# Altium project TMDX654GPEVM.PrjPcb (part 2 of 24)

## Sheet 12-SoC POWER2.SchDoc
size 513 x 386 mm
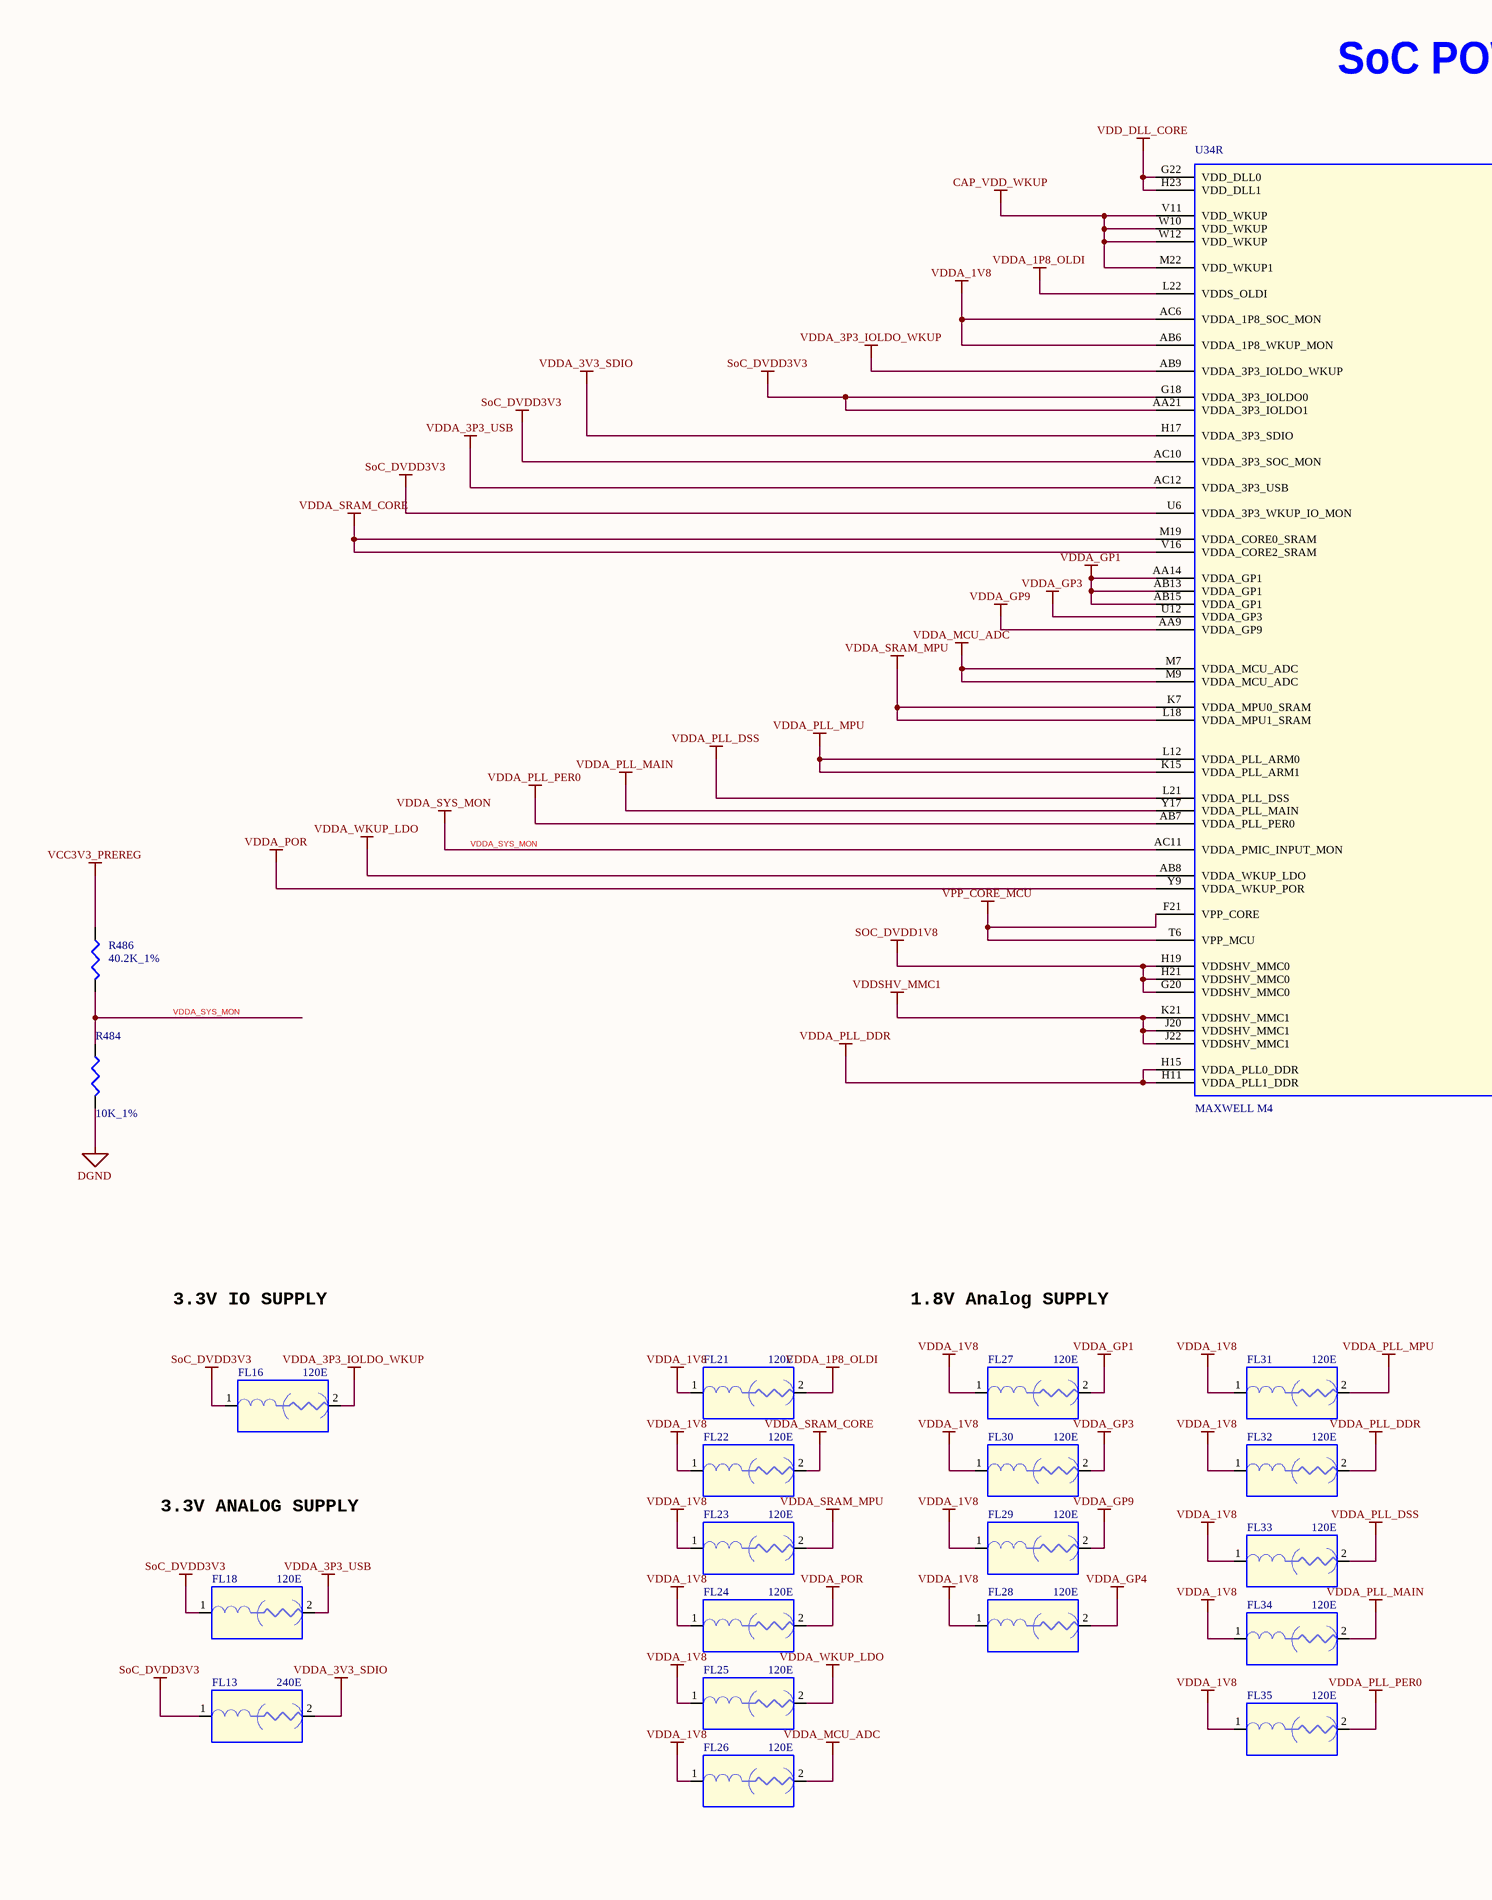
[diagram p15: 12-SoC POWER2.SchDoc, left]
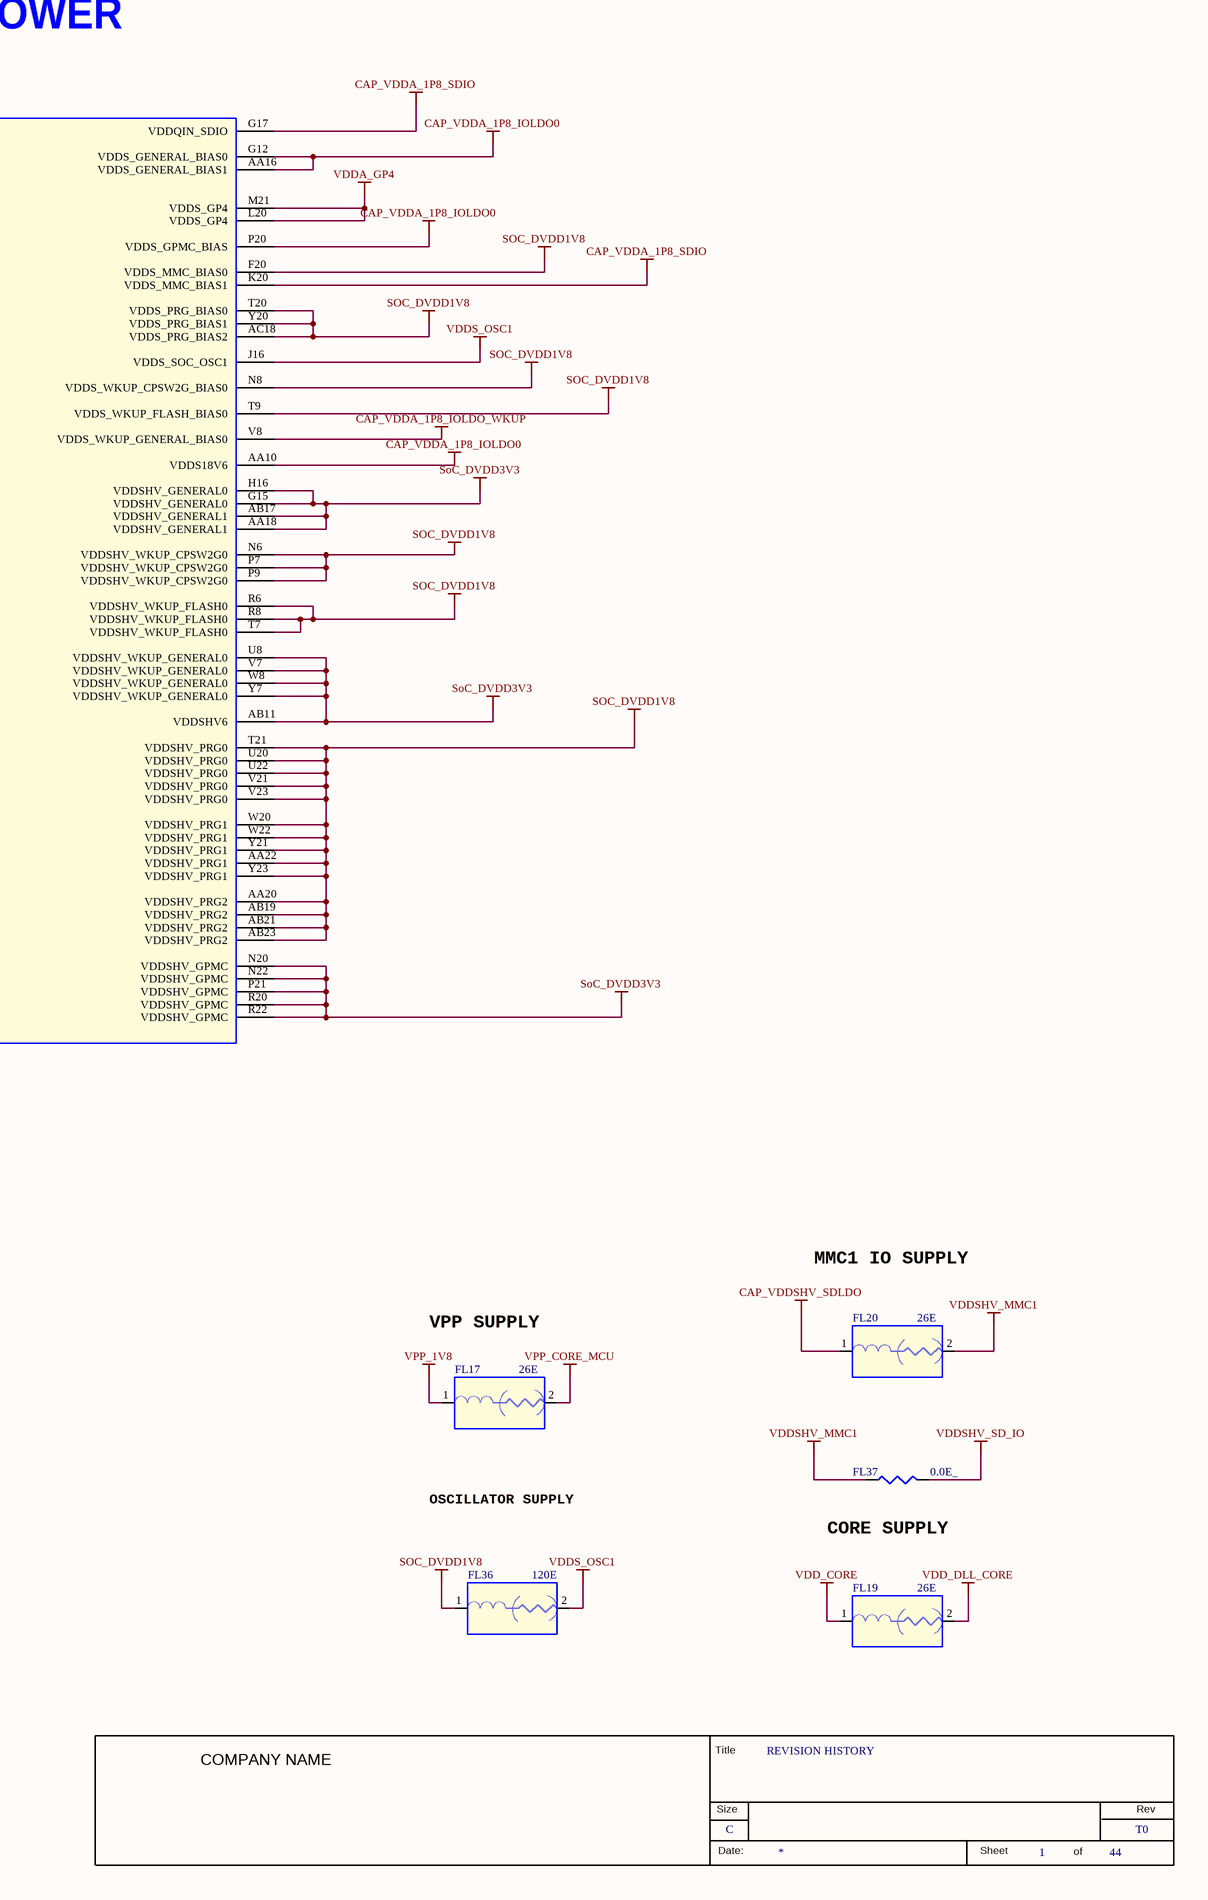
[diagram p16: 12-SoC POWER2.SchDoc, right]

### Parts
(Parts that share a designator on the sheet are numbered #1, #2 ... from top to bottom, then left to right.)
*#12  RevCode: T0  Title: REVISION HISTORY  Page Size: C  Page Number: 1  Page Count: 44  (hidden comment: TRAINING_TITLEBLK_CSIZE)  (graphical)
FL13  240E  [EMIFIL_BLM03B_0201]
FL16  120E  [EMIFIL_BLM18R_0603_1]
FL17  26E  [EMIFIL_BLM18K_0603]
FL18  120E  [EMIFIL_BLM18R_0603_1]
FL19  26E  [EMIFIL_BLM18K_0603]
FL20  26E  [EMIFIL_BLM18K_0603]
FL21  120E  [EMIFIL_BLM18R_0603_1]
FL22  120E  [EMIFIL_BLM18R_0603_1]
FL23  120E  [EMIFIL_BLM18R_0603_1]
FL24  120E  [EMIFIL_BLM18R_0603_1]
FL25  120E  [EMIFIL_BLM18R_0603_1]
FL26  120E  [EMIFIL_BLM18R_0603_1]
FL27  120E  [EMIFIL_BLM18R_0603_1]
FL28  120E  [EMIFIL_BLM18R_0603_1]
FL29  120E  [EMIFIL_BLM18R_0603_1]
FL30  120E  [EMIFIL_BLM18R_0603_1]
FL31  120E  [EMIFIL_BLM18R_0603_1]
FL32  120E  [EMIFIL_BLM18R_0603_1]
FL33  120E  [EMIFIL_BLM18R_0603_1]
FL34  120E  [EMIFIL_BLM18R_0603_1]
FL35  120E  [EMIFIL_BLM18R_0603_1]
FL36  120E  [EMIFIL_BLM18R_0603_1]
FL37  0.0E_  [RES0603]
R484  10K_1%  [RES0402_0-5]
R486  40.2K_1%  [RES0402_0-5]
U34  MAXWELL M4  [BGA784_31-49_910X910_1-7]  (part R of 19)

### Nets
CAP_VDD_WKUP: U34.M22(VDD_WKUP1) U34.V11(VDD_WKUP) U34.W10(VDD_WKUP) U34.W12(VDD_WKUP)
CAP_VDDA_1P8_IOLDO0: U34.AA10(VDDS18V6) U34.AA16(VDDS_GENERAL_BIAS1) U34.G12(VDDS_GENERAL_BIAS0) U34.P20(VDDS_GPMC_BIAS)
CAP_VDDA_1P8_IOLDO_WKUP: U34.V8(VDDS_WKUP_GENERAL_BIAS0)
CAP_VDDA_1P8_SDIO: U34.G17(VDDQIN_SDIO) U34.K20(VDDS_MMC_BIAS1)
CAP_VDDSHV_SDLDO: FL20.1
DGND: R484.2
SOC_DVDD1V8: FL36.1 U34.AA20(VDDSHV_PRG2) U34.AA22(VDDSHV_PRG1) U34.AB19(VDDSHV_PRG2) U34.AB21(VDDSHV_PRG2) U34.AB23(VDDSHV_PRG2) U34.AC18(VDDS_PRG_BIAS2) U34.F20(VDDS_MMC_BIAS0) U34.G20(VDDSHV_MMC0) U34.H19(VDDSHV_MMC0) U34.H21(VDDSHV_MMC0) U34.N6(VDDSHV_WKUP_CPSW2G0) U34.N8(VDDS_WKUP_CPSW2G_BIAS0) U34.P7(VDDSHV_WKUP_CPSW2G0) U34.P9(VDDSHV_WKUP_CPSW2G0) U34.R6(VDDSHV_WKUP_FLASH0) U34.R8(VDDSHV_WKUP_FLASH0) U34.T7(VDDSHV_WKUP_FLASH0) U34.T9(VDDS_WKUP_FLASH_BIAS0) U34.T20(VDDS_PRG_BIAS0) U34.T21(VDDSHV_PRG0) U34.U20(VDDSHV_PRG0) U34.U22(VDDSHV_PRG0) U34.V21(VDDSHV_PRG0) U34.V23(VDDSHV_PRG0) U34.W20(VDDSHV_PRG1) U34.W22(VDDSHV_PRG1) U34.Y20(VDDS_PRG_BIAS1) U34.Y21(VDDSHV_PRG1) U34.Y23(VDDSHV_PRG1)
SoC_DVDD3V3: FL13.1 FL16.1 FL18.1 U34.AA18(VDDSHV_GENERAL1) U34.AA21(VDDA_3P3_IOLDO1) U34.AB11(VDDSHV6) U34.AB17(VDDSHV_GENERAL1) U34.AC10(VDDA_3P3_SOC_MON) U34.G15(VDDSHV_GENERAL0) U34.G18(VDDA_3P3_IOLDO0) U34.H16(VDDSHV_GENERAL0) U34.N20(VDDSHV_GPMC) U34.N22(VDDSHV_GPMC) U34.P21(VDDSHV_GPMC) U34.R20(VDDSHV_GPMC) U34.R22(VDDSHV_GPMC) U34.U6(VDDA_3P3_WKUP_IO_MON) U34.U8(VDDSHV_WKUP_GENERAL0) U34.V7(VDDSHV_WKUP_GENERAL0) U34.W8(VDDSHV_WKUP_GENERAL0) U34.Y7(VDDSHV_WKUP_GENERAL0)
VCC3V3_PREREG: R486.1
VDD_CORE: FL19.1
VDD_DLL_CORE: FL19.2 U34.G22(VDD_DLL0) U34.H23(VDD_DLL1)
VDDA_1P8_OLDI: FL21.2 U34.L22(VDDS_OLDI)
VDDA_1V8: FL21.1 FL22.1 FL23.1 FL24.1 FL25.1 FL26.1 FL27.1 FL28.1 FL29.1 FL30.1 FL31.1 FL32.1 FL33.1 FL34.1 FL35.1 U34.AB6(VDDA_1P8_WKUP_MON) U34.AC6(VDDA_1P8_SOC_MON)
VDDA_3P3_IOLDO_WKUP: FL16.2 U34.AB9(VDDA_3P3_IOLDO_WKUP)
VDDA_3P3_USB: FL18.2 U34.AC12(VDDA_3P3_USB)
VDDA_3V3_SDIO: FL13.2 U34.H17(VDDA_3P3_SDIO)
VDDA_GP1: FL27.2 U34.AA14(VDDA_GP1) U34.AB13(VDDA_GP1) U34.AB15(VDDA_GP1)
VDDA_GP3: FL30.2 U34.U12(VDDA_GP3)
VDDA_GP4: FL28.2 U34.L20(VDDS_GP4) U34.M21(VDDS_GP4)
VDDA_GP9: FL29.2 U34.AA9(VDDA_GP9)
VDDA_MCU_ADC: FL26.2 U34.M7(VDDA_MCU_ADC) U34.M9(VDDA_MCU_ADC)
VDDA_PLL_DDR: FL32.2 U34.H11(VDDA_PLL1_DDR) U34.H15(VDDA_PLL0_DDR)
VDDA_PLL_DSS: FL33.2 U34.L21(VDDA_PLL_DSS)
VDDA_PLL_MAIN: FL34.2 U34.Y17(VDDA_PLL_MAIN)
VDDA_PLL_MPU: FL31.2 U34.K15(VDDA_PLL_ARM1) U34.L12(VDDA_PLL_ARM0)
VDDA_PLL_PER0: FL35.2 U34.AB7(VDDA_PLL_PER0)
VDDA_POR: FL24.2 U34.Y9(VDDA_WKUP_POR)
VDDA_SRAM_CORE: FL22.2 U34.M19(VDDA_CORE0_SRAM) U34.V16(VDDA_CORE2_SRAM)
VDDA_SRAM_MPU: FL23.2 U34.K7(VDDA_MPU0_SRAM) U34.L18(VDDA_MPU1_SRAM)
VDDA_SYS_MON: R484.1 R486.2 U34.AC11(VDDA_PMIC_INPUT_MON)
VDDA_WKUP_LDO: FL25.2 U34.AB8(VDDA_WKUP_LDO)
VDDS_OSC1: FL36.2 U34.J16(VDDS_SOC_OSC1)
VDDSHV_MMC1: FL20.2 FL37.1 U34.J20(VDDSHV_MMC1) U34.J22(VDDSHV_MMC1) U34.K21(VDDSHV_MMC1)
VDDSHV_SD_IO: FL37.2
VPP_1V8: FL17.1
VPP_CORE_MCU: FL17.2 U34.F21(VPP_CORE) U34.T6(VPP_MCU)

### Notes on the sheet
- SoC POWER
- 3.3V IO SUPPLY
- 1.8V Analog SUPPLY
- MMC1 IO SUPPLY
- VPP SUPPLY
- 3.3V ANALOG SUPPLY
- OSCILLATOR SUPPLY
- (near FL37) CORE SUPPLY
- (in symbol TRAINING_TITLEBLK_CSIZE) Title; COMPANY NAME; Size; Rev; Date:; Sheet; of

### Library data of the parts
*#12 = TRAINING_TITLEBLK_CSIZE: Issue: 1.0; Page Create Date: Jan  8, 2022; Page Modify Date: *
FL13 = EMIFILTER_IND: FERRITE CHIP 240E 350mA 0201; Mistral Part No: 130014070021-R; Mfr_name: MURATA; Mfr_part_number: BLM03AX241SN1D; Part_type: MISC\FILTER; Project: HUMANWARE_PHOENIX; Tolerance: NA; Customs_HS_Code: 85437099; Custom_Duty: 24%; Library Ref: EMIFILTER_IND; PCB Footprint: EMIFIL_BLM03B_0201; Voltage: NA; Wattage: NA; Package: 0201; Distributor_name: DIGIKEY; Distributor_part_number: 490-5623-1-ND; Height: 0.33MM; Weight: NA; Temperature: -55°C+125°C; Datasheet: Y:\MIS_DATABASE\DATASHEETS\DISCRETES\INDUCTORS\BLM03AX.PDF; Crtd /date: NAVEED/140714; Chkd/date: VASANTHA/070814
FL16 FL18 FL21-FL23 FL25 FL27 FL30 FL32-FL35 = EMIFILTER_IND: FERRITE BEAD 120E 2A 0603; Mistral Part No: 130010060030-R; Mfr_name: MURATA; Mfr_part_number: BLM18EG121SN1D; Part_type: MISC\FILTER; Project: CENTAURUS; Tolerance: NA; Customs_HS_Code: 85437099; Custom_Duty: 24%; Footprint Path: Y:\MIS_DATABASE\Library\ALTIUM_TOOL\PCB_FOOTPRINTS\Altium_Footprint_Lib.PcbLib; Library Path: Y:\MIS_DATABASE\Library\ALTIUM_TOOL\SCHEMATICS_PARTS\MS_FILTER_Library.schlib; PCB Footprint: EMIFIL_BLM18R_0603_1; Voltage: NA; Wattage: NA; Package: 0603; Distributor_name: DIGIKEY; Distributor_part_number: 490-3991-1-ND; Library Ref: EMIFILTER_IND; Footprint Ref: EMIFIL_BLM18R_0603_1; Height: 0.95MM; Weight: NA; Temperature: -55°C+125°C; Datasheet: Y:\MIS_DATABASE\DATASHEETS\DISCRETES\INDUCTORS\BLM18E.PDF; Crtd /date: MUDDU/190610; Chkd/date: VASANTHA/061216; MECHANICAL 3D STEP FILE: EMIFIL_BLM18R_0603_1
FL17 = EMIFILTER_IND: FERRITE CHIP 26E 6A 0603; Mistral Part No: 130012010003-R; Mfr_name: MURATA; Mfr_part_number: BLM18KG260TN1D; Part_type: MISC\FILTER; Project: NA10NG; Tolerance: NA; Customs_HS_Code: 85437099; Custom_Duty: 24%; PCB Footprint: EMIFIL_BLM18K_0603; Voltage: NA; Wattage: NA; Package: 0603; Distributor_name: DIGIKEY; Distributor_part_number: 490-5252-1-ND; Library Ref: EMIFILTER_IND; Height: 0.75MM; Weight: NA; Temperature: -55°C+125°C; Datasheet: Y:\MIS_DATABASE\DATASHEETS\DISCRETES\INDUCTORS\BLM18K-SERIES.PDF; Crtd /date: CHAITHANYA/020112; Chkd/date: USMAN/020112
FL19 FL20 = EMIFILTER_IND: FERRITE CHIP 26E 6A 0603; Part_type: MISC\FILTER; Mfr_part_number: BLM18KG260TN1D; Mfr_name: MURATA; Mistral Part No: 130012010003-R; Custom_Duty: 24%; Customs_HS_Code: 85437099; Wattage: NA; Project: NA10NG; PCB Footprint: EMIFIL_BLM18K_0603; Chkd/date: USMAN/020112; Crtd /date: CHAITHANYA/020112; Datasheet: Y:\MIS_DATABASE\DATASHEETS\DISCRETES\INDUCTORS\BLM18K-SERIES.PDF; Temperature: -55°C+125°C; Weight: NA; Height: 0.75MM; Library Ref: EMIFILTER_IND; Distributor_part_number: 490-5252-1-ND; Distributor_name: DIGIKEY; Package: 0603; Voltage: NA; Tolerance: NA
FL24 FL26 FL28 FL29 FL31 FL36 = EMIFILTER_IND: FERRITE BEAD 120E 2A 0603; Part_type: MISC\FILTER; Mfr_part_number: BLM18EG121SN1D; Mfr_name: MURATA; Mistral Part No: 130010060030-R; Custom_Duty: 24%; Customs_HS_Code: 85437099; Wattage: NA; Project: CENTAURUS; Footprint Path: Y:\MIS_DATABASE\Library\ALTIUM_TOOL\PCB_FOOTPRINTS\Altium_Footprint_Lib.PcbLib; Library Path: Y:\MIS_DATABASE\Library\ALTIUM_TOOL\SCHEMATICS_PARTS\MS_FILTER_Library.schlib; PCB Footprint: EMIFIL_BLM18R_0603_1; MECHANICAL 3D STEP FILE: EMIFIL_BLM18R_0603_1; Chkd/date: VASANTHA/061216; Crtd /date: MUDDU/190610; Datasheet: Y:\MIS_DATABASE\DATASHEETS\DISCRETES\INDUCTORS\BLM18E.PDF; Temperature: -55°C+125°C; Weight: NA; Height: 0.95MM; Footprint Ref: EMIFIL_BLM18R_0603_1; Library Ref: EMIFILTER_IND; Distributor_part_number: 490-3991-1-ND; Distributor_name: DIGIKEY; Package: 0603; Voltage: NA; Tolerance: NA
FL37 = RESISTOR: RES 0.0E 1/10W 0603; Mistral Part No: 110010020006-P; Mfr_name: VISHAY; Mfr_part_number: CRCW06030000Z0EA; Part_type: RESISTORS\FIXED; Project: NPOL_CONTROLLERCARD; Voltage: 50V; Customs_HS_Code: 85332119; Custom_Duty: 15%; Wattage: 1/10W; Package: 0603; Distributor_name: DIGIKEY; Distributor_part_number: 541-0.0GCT-ND; Library Ref: RESISTOR; Height: 0.55MM; Weight: 2g/1000pcs; Temperature: -55°C+125°C; Datasheet: Y:\MIS_DATABASE\DATASHEETS\RESISTORS\CRCW.PDF; Crtd /date: MUDDU/050210; Chkd/date: SUHAS/230910; RoHS: Pb-Free; PCB Footprint: RES0603
R484 = RESISTOR_Dup5: RES 10K 1/16W 1% 0402; Part_type: RESISTORS\FIXED; Mfr_part_number: RC0402FR-0710KL; Mfr_name: YAGEO AMERICA; Mistral Part No: 110009030220-P; Custom_Duty: 15%; Customs_HS_Code: 85332119; Voltage: NA; Project: VOCERA; Footprint Path: Y:\MIS_DATABASE\Library\ALTIUM_TOOL\PCB_FOOTPRINTS\Altium_Footprint_Lib.PcbLib; Library Path: Y:\MIS_DATABASE\Library\ALTIUM_TOOL\SCHEMATICS_PARTS\MS_DISCRETE_Library.schlib; Footprint Ref: RES0402_0-5; Library Ref: RESISTOR; MECHANICAL 3D STEP FILE: RES0402_0-5; PCB Footprint: RES0402_0-5; RoHS: Pb-Free; Chkd/date: VASANTHA/201216; Crtd /date: GEETHA/290506; Datasheet: Y:\MIS_DATABASE\DATASHEETS\RESISTORS\YAGEO-RC0402.PDF; Temperature: -55°C+155°C; Weight: 0.65mg; Height: 0.40MM; Distributor_part_number: 311-10.0KLRTR-ND; Distributor_name: DIGIKEY; Package: 0402; Wattage: 1/16W; Tolerance: 1%
R486 = RESISTOR_Dup5: RES 40.2K 1/16W 1% 0402; Part_type: RESISTORS\FIXED; Mfr_part_number: RC0402FR-0740K2L; Mfr_name: YAGEO AMERICA; Mistral Part No: 110009030811; Custom_Duty: 15%; Customs_HS_Code: 85332119; Voltage: NA; Project: G4SLIM; PCB Footprint: RES0402_0-5; Footprint Path: Y:\MIS_DATABASE\Library\ALTIUM_TOOL\PCB_FOOTPRINTS\Altium_Footprint_Lib.PcbLib; Library Path: Y:\MIS_DATABASE\Library\ALTIUM_TOOL\SCHEMATICS_PARTS\MS_DISCRETE_Library.schlib; MECHANICAL 3D STEP FILE: RES0402_0-5; Chkd/date: VASANTHA/291216; Crtd /date: MAZHAR/170505; Datasheet: Y:\MIS_DATABASE\DATASHEETS\RESISTORS\YAGEO_RES.PDF; Temperature: -55°C+155°C; Weight: 0.65mg; Height: 0.40MM; Library Ref: RESISTOR; Distributor_part_number: 311-40.2KLRDKR-ND; Distributor_name: DIGIKEY; Package: 0402; Wattage: 1/16W; Tolerance: 1%; Footprint Ref: RES0402_0-5
U34 = AM654X_BGA784: IC MAXWELL MICRO CONTROLLER UNIT BGA784; Part_type: ICS\DIGITAL\MICROCONTROLLER; Mfr_part_number: MAXWELL M4_EVM; Mfr_name: TEXAS INSTRUMENTS; Mistral Part No: 141217100003; Custom_Duty: 15%; Customs_HS_Code: 85423100; Wattage: NA; Project: TI_MAXIE_CPB; Library Ref: AM654X_BGA784; PCB Footprint: BGA784_31-49_910X910_1-7; MECHANICAL 3D STEP FILE: BGA784_31-49_910X910_1-7; Chkd/date: MANIRAJA/130717; Crtd /date: MANIRAJA/130717; Datasheet: Y:\MIS_DATABASE\DATASHEETS\ICS\DIGITAL\MICROCONTROLLER\MAXWELLM4.PDF; Temperature: NA; Weight: NA; Height: 1.63MM; Distributor_part_number: NA; Distributor_name: NA; Package: BGA784; Voltage: NA; Tolerance: NA

## Sheet 13-SoC POWER3.SchDoc
size 513 x 386 mm
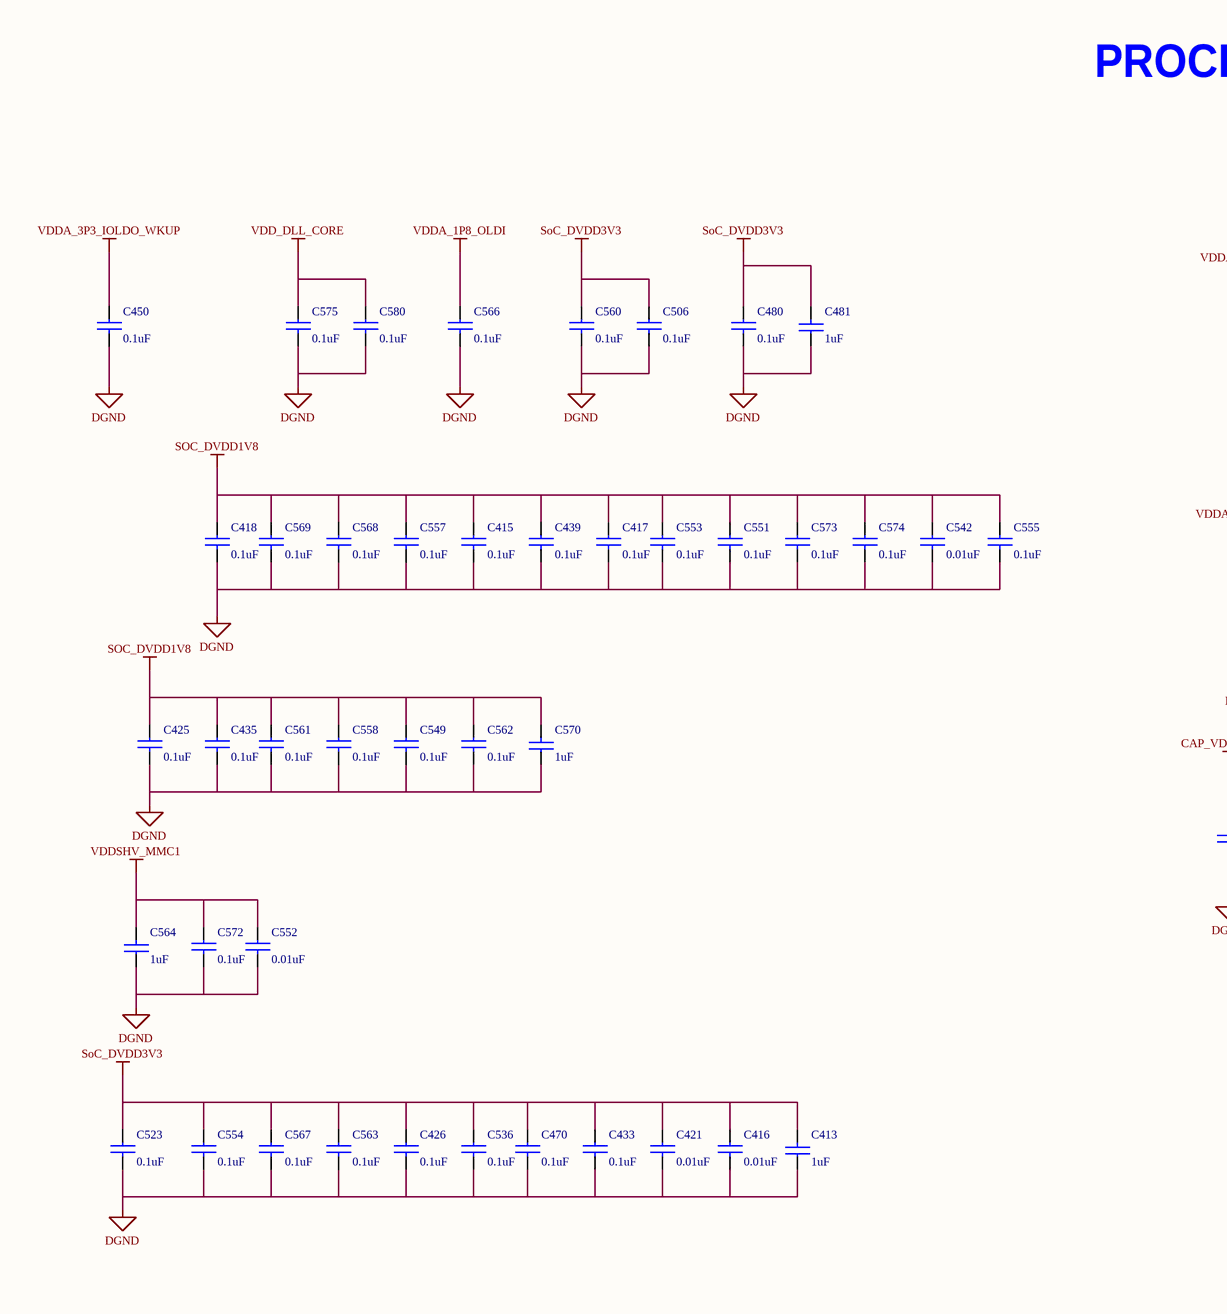
[diagram p17: 13-SoC POWER3.SchDoc, left]
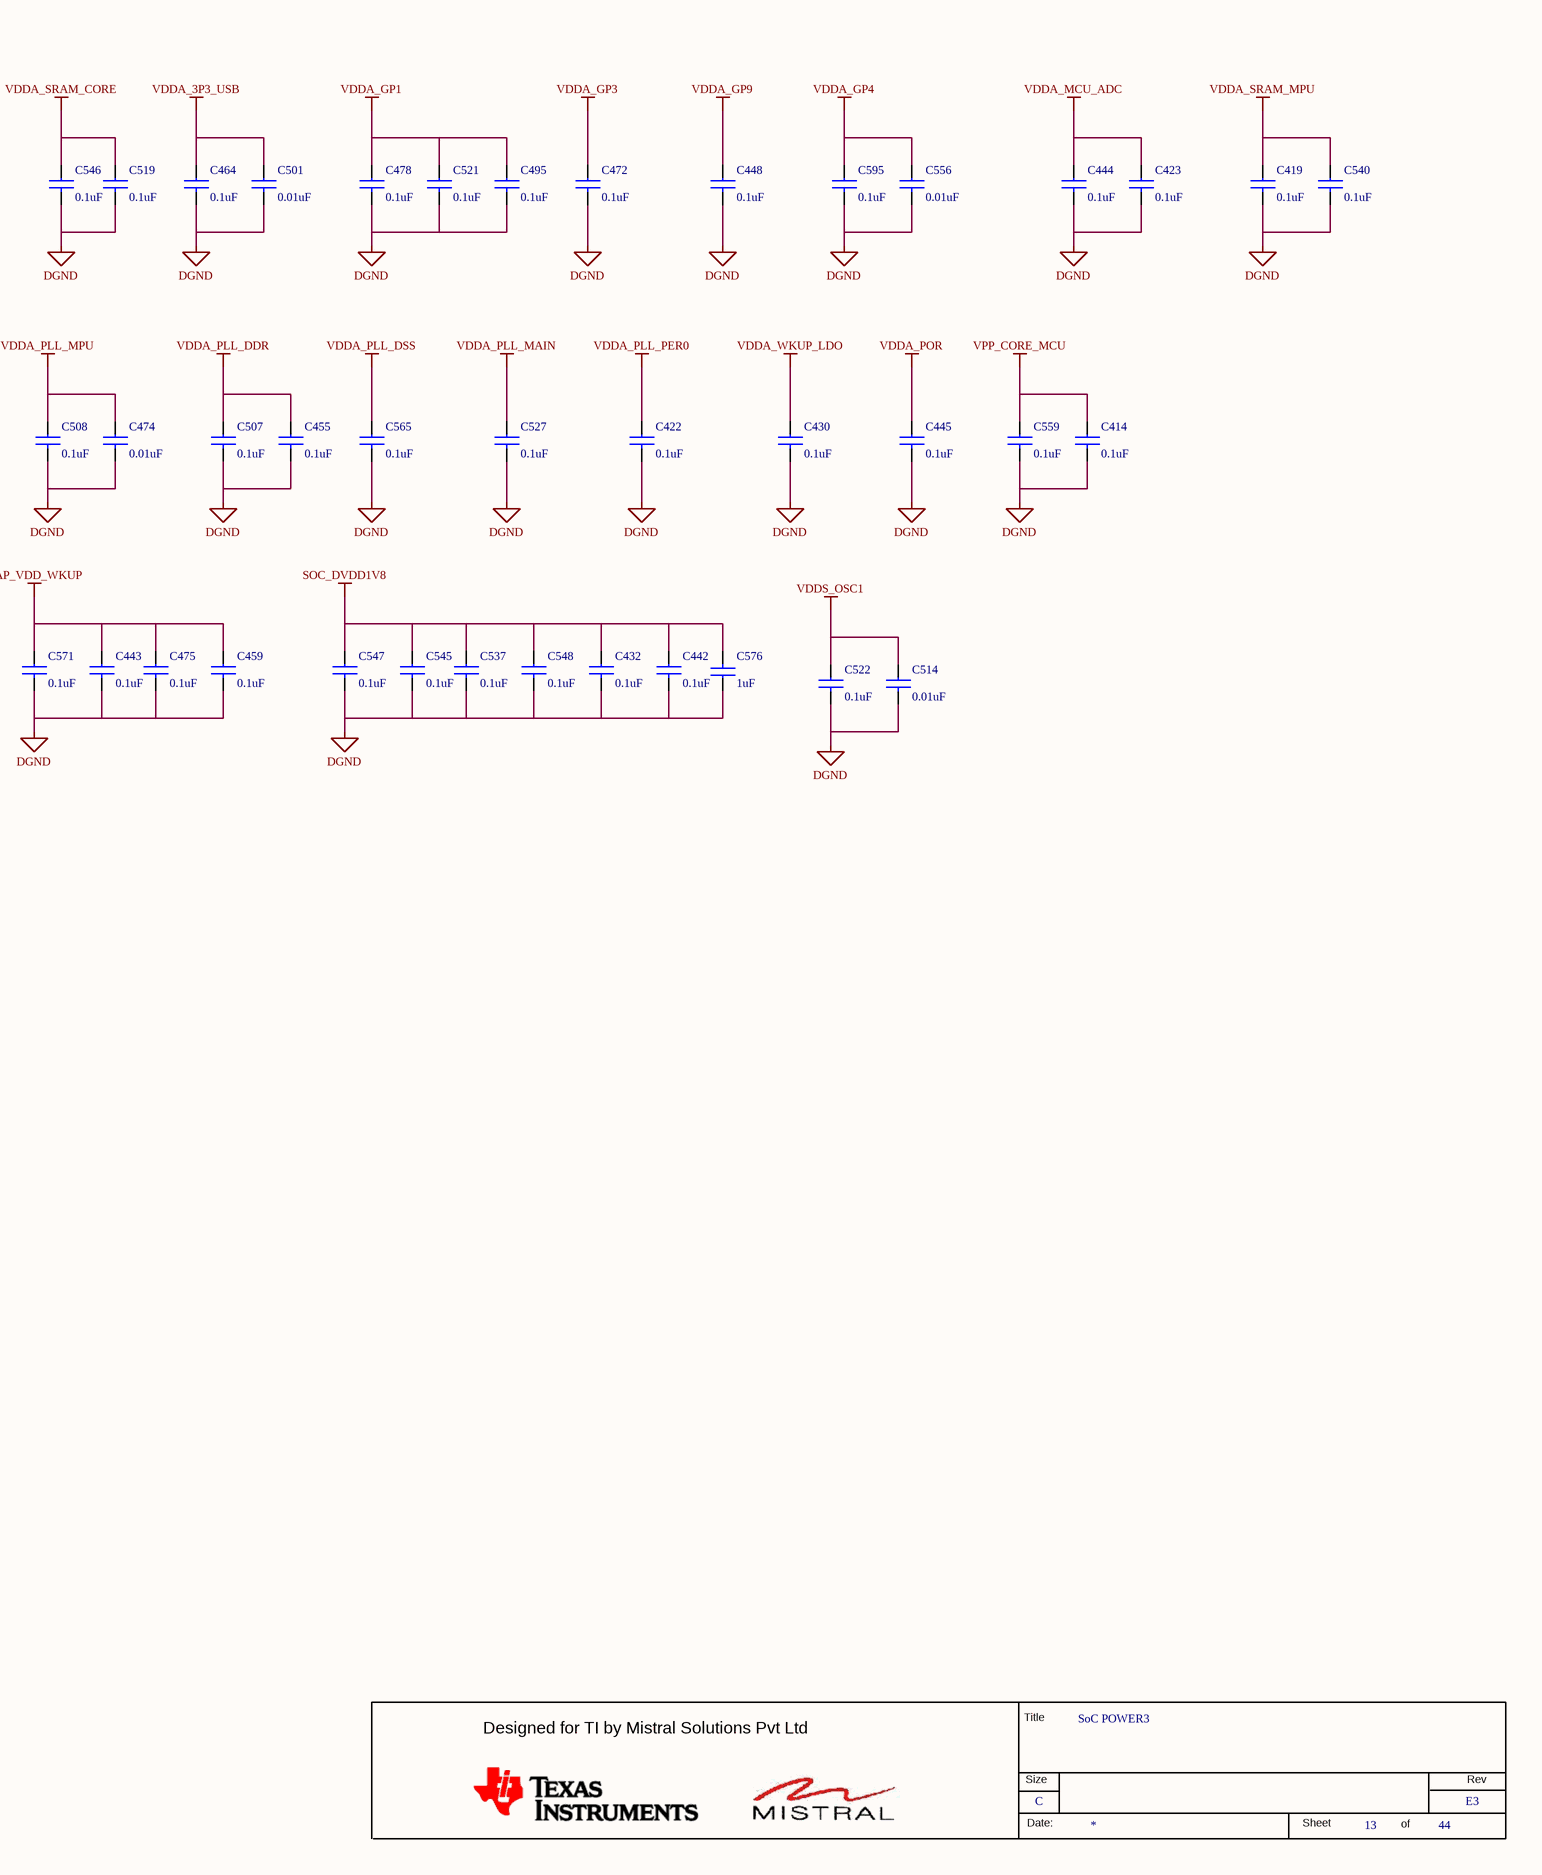
[diagram p18: 13-SoC POWER3.SchDoc, right]

### Parts
(Parts that share a designator on the sheet are numbered #1, #2 ... from top to bottom, then left to right.)
*#13  RevCode: E3  Title: SoC POWER3  Page Size: C  Page Number: 13  Page Count: 44  (hidden comment: MISTRAL_TITLEBLK_CSIZE)  (graphical)
C413  1uF  [CAP0402_0-75]
C414  0.1uF  [CAP0201_0-5]
C415  0.1uF  [CAP0201_0-5]
C416  0.01uF  [CAP0201_0-5]
C417  0.1uF  [CAP0201_0-5]
C418  0.1uF  [CAP0201_0-5]
C419  0.1uF  [CAP0201_0-5]
C421  0.01uF  [CAP0201_0-5]
C422  0.1uF  [CAP0201_0-5]
C423  0.1uF  [CAP0201_0-5]
C425  0.1uF  [CAP0201_0-5]
C426  0.1uF  [CAP0201_0-5]
C430  0.1uF  [CAP0201_0-5]
C432  0.1uF  [CAP0201_0-5]
C433  0.1uF  [CAP0201_0-5]
C435  0.1uF  [CAP0201_0-5]
C439  0.1uF  [CAP0201_0-5]
C442  0.1uF  [CAP0201_0-5]
C443  0.1uF  [CAP0201_0-5]
C444  0.1uF  [CAP0201_0-5]
C445  0.1uF  [CAP0201_0-5]
C448  0.1uF  [CAP0201_0-5]
C450  0.1uF  [CAP0201_0-5]
C455  0.1uF  [CAP0201_0-5]
C459  0.1uF  [CAP0201_0-5]
C464  0.1uF  [CAP0201_0-5]
C470  0.1uF  [CAP0201_0-5]
C472  0.1uF  [CAP0201_0-5]
C474  0.01uF  [CAP0201_0-5]
C475  0.1uF  [CAP0201_0-5]
C478  0.1uF  [CAP0201_0-5]
C480  0.1uF  [CAP0201_0-5]
C481  1uF  [CAP0402_0-75]
C495  0.1uF  [CAP0201_0-5]
C501  0.01uF  [CAP0201_0-5]
C506  0.1uF  [CAP0201_0-5]
C507  0.1uF  [CAP0201_0-5]
C508  0.1uF  [CAP0201_0-5]
C514  0.01uF  [CAP0201_0-5]
C519  0.1uF  [CAP0201_0-5]
C521  0.1uF  [CAP0201_0-5]
C522  0.1uF  [CAP0201_0-5]
C523  0.1uF  [CAP0201_0-5]
C527  0.1uF  [CAP0201_0-5]
C536  0.1uF  [CAP0201_0-5]
C537  0.1uF  [CAP0201_0-5]
C540  0.1uF  [CAP0201_0-5]
C542  0.01uF  [CAP0201_0-5]
C545  0.1uF  [CAP0201_0-5]
C546  0.1uF  [CAP0201_0-5]
C547  0.1uF  [CAP0201_0-5]
C548  0.1uF  [CAP0201_0-5]
C549  0.1uF  [CAP0201_0-5]
C551  0.1uF  [CAP0201_0-5]
C552  0.01uF  [CAP0201_0-5]
C553  0.1uF  [CAP0201_0-5]
C554  0.1uF  [CAP0201_0-5]
C555  0.1uF  [CAP0201_0-5]
C556  0.01uF  [CAP0201_0-5]
C557  0.1uF  [CAP0201_0-5]
C558  0.1uF  [CAP0201_0-5]
C559  0.1uF  [CAP0201_0-5]
C560  0.1uF  [CAP0201_0-5]
C561  0.1uF  [CAP0201_0-5]
C562  0.1uF  [CAP0201_0-5]
C563  0.1uF  [CAP0201_0-5]
C564  1uF  [CAP0402_0-75]
C565  0.1uF  [CAP0201_0-5]
C566  0.1uF  [CAP0201_0-5]
C567  0.1uF  [CAP0201_0-5]
C568  0.1uF  [CAP0201_0-5]
C569  0.1uF  [CAP0201_0-5]
C570  1uF  [CAP0402_0-75]
C571  0.1uF  [CAP0201_0-5]
C572  0.1uF  [CAP0201_0-5]
C573  0.1uF  [CAP0201_0-5]
C574  0.1uF  [CAP0201_0-5]
C575  0.1uF  [CAP0201_0-5]
C576  1uF  [CAP0402_0-75]
C580  0.1uF  [CAP0201_0-5]
C595  0.1uF  [CAP0201_0-5]

### Nets
CAP_VDD_WKUP: C443.1 C459.1 C475.1 C571.1
DGND: C413.1 C414.2 C415.2 C416.2 C417.2 C418.2 C419.2 C421.2 C422.2 C423.2 C425.2 C426.2 C430.2 C432.2 C433.2 C435.2 C439.2 C442.2 C443.2 C444.2 C445.2 C448.2 C450.2 C455.2 C459.2 C464.2 C470.2 C472.2 C474.2 C475.2 C478.2 C480.2 C481.1 C495.2 C501.2 C506.2 C507.2 C508.2 C514.2 C519.2 C521.2 C522.2 C523.2 C527.2 C536.2 C537.2 C540.2 C542.2 C545.2 C546.2 C547.2 C548.2 C549.2 C551.2 C552.2 C553.2 C554.2 C555.2 C556.2 C557.2 C558.2 C559.2 C560.2 C561.2 C562.2 C563.2 C564.1 C565.2 C566.2 C567.2 C568.2 C569.2 C570.1 C571.2 C572.2 C573.2 C574.2 C575.2 C576.1 C580.2 C595.2
SOC_DVDD1V8: C415.1 C417.1 C418.1 C425.1 C432.1 C435.1 C439.1 C442.1 C537.1 C542.1 C545.1 C547.1 C548.1 C549.1 C551.1 C553.1 C555.1 C557.1 C558.1 C561.1 C562.1 C568.1 C569.1 C570.2 C573.1 C574.1 C576.2
SoC_DVDD3V3: C413.2 C416.1 C421.1 C426.1 C433.1 C470.1 C480.1 C481.2 C506.1 C523.1 C536.1 C554.1 C560.1 C563.1 C567.1
VDD_DLL_CORE: C575.1 C580.1
VDDA_1P8_OLDI: C566.1
VDDA_3P3_IOLDO_WKUP: C450.1
VDDA_3P3_USB: C464.1 C501.1
VDDA_GP1: C478.1 C495.1 C521.1
VDDA_GP3: C472.1
VDDA_GP4: C556.1 C595.1
VDDA_GP9: C448.1
VDDA_MCU_ADC: C423.1 C444.1
VDDA_PLL_DDR: C455.1 C507.1
VDDA_PLL_DSS: C565.1
VDDA_PLL_MAIN: C527.1
VDDA_PLL_MPU: C474.1 C508.1
VDDA_PLL_PER0: C422.1
VDDA_POR: C445.1
VDDA_SRAM_CORE: C519.1 C546.1
VDDA_SRAM_MPU: C419.1 C540.1
VDDA_WKUP_LDO: C430.1
VDDS_OSC1: C514.1 C522.1
VDDSHV_MMC1: C552.1 C564.2 C572.1
VPP_CORE_MCU: C414.1 C559.1

### Notes on the sheet
- PROCESSOR DECAPS
- (in symbol MISTRAL_TITLEBLK_CSIZE) Title; Designed for TI by Mistral Solutions Pvt Ltd; Size; Rev; Date:; Sheet; of

### Library data of the parts
*#13 = MISTRAL_TITLEBLK_CSIZE: Issue: 1.0; Page Create Date: March  8, 1995; Page Modify Date: *
C413 C481 C564 = CAP_Dup5: as C114 on sheet 11-SoC POWER1; Footprint Path: Y:\MIS_DATABASE\Library\ALTIUM_TOOL\PCB_FOOTPRINTS\Altium_Footprint_Lib.PcbLib; Library Path: Y:\MIS_DATABASE\Library\ALTIUM_TOOL\SCHEMATICS_PARTS\MS_DISCRETE_Library.schlib; MECHANICAL 3D STEP FILE: CAP0402_0-75; PCB Footprint: CAP0402_0-75; Chkd/date: MANIRAJA/150218; Crtd /date: ALVY/150218; Datasheet: Y:\MIS_DATABASE\DATASHEETS\CAPACITORS\EMK105BJ105MV-F.PDF; Temperature: -55°C+85°C; Weight: 0.65mg; Height: 0.55MM; Distributor_part_number: 587-5514-1-ND; Distributor_name: DIGIKEY; Package: 0402; Voltage: 16V; Tolerance: 20%; Library Ref: CAP; Footprint Ref: CAP0402_0-75
C414 C415 C418 C422 C423 C425 C432 C433 C439 C442 C448 C450 C459 C464 C472 C480 C506-C508 C519 C521 C522 C527 C536 C537 C540 C545 C553 C558 C562 C566-C568 C571-C573 C580 = CAP_Dup5: as C240 on sheet 10-SoC CLOCK AND RESET; PCB Footprint: CAP0201_0-5; Tolerance: 10%; Voltage: 16V; Package: 0201; Distributor_name: DIGIKEY; Distributor_part_number: 490-16742-1-ND; Height: 0.33MM; Weight: 0.33mg; Temperature: -55°C+85°C; Datasheet: Y:\MIS_DATABASE\DATASHEETS\CAPACITORS\GRM033R61C104KE84.PDF; Crtd /date: MANIRAJA/120218; Chkd/date: MANIRAJA/120218; MECHANICAL 3D STEP FILE: CAP0201_0-5; Library Ref: CAP
C416 C421 C556 = CAP_Dup5: CAP CERAMIC 0.01uF 25V 10% X5R 0201; Part_type: CAPACITORS\CERAMIC; Mfr_part_number: GRM033R61E103KA12J; Mfr_name: MURATA; Mistral Part No: 120018010007-R; Custom_Duty: 15%; Customs_HS_Code: 85322990; Project: TI_MAXIE_CPB; Wattage: NA; PCB Footprint: CAP0201_0-5; Chkd/date: MANIRAJA/230118; Crtd /date: MANIRAJA/230118; Datasheet: Y:\MIS_DATABASE\DATASHEETS\CAPACITORS\GRM033R61E103KA12.PDF; Height: 0.33MM; Distributor_part_number: GRM033R61E103KA12J-ND; Distributor_name: DIGIKEY; Package: 0201; Voltage: 25V; Tolerance: 10%; Weight: 0.33mg; Temperature: -55°C+85°C; MECHANICAL 3D STEP FILE: CAP0201_0-5; Library Ref: CAP
C417 C419 C426 C430 C435 C443-C445 C455 C470 C475 C478 C495 C523 C546-C549 C551 C554 C555 C557 C559-C561 C563 C565 C569 C574 C575 C595 = CAP_Dup5: as C237 on sheet 10-SoC CLOCK AND RESET; PCB Footprint: CAP0201_0-5; MECHANICAL 3D STEP FILE: CAP0201_0-5; Chkd/date: MANIRAJA/120218; Crtd /date: MANIRAJA/120218; Datasheet: Y:\MIS_DATABASE\DATASHEETS\CAPACITORS\GRM033R61C104KE84.PDF; Temperature: -55°C+85°C; Weight: 0.33mg; Height: 0.33MM; Distributor_part_number: 490-16742-1-ND; Distributor_name: DIGIKEY; Package: 0201; Voltage: 16V; Tolerance: 10%; Library Ref: CAP
C474 C501 C514 C542 C552 = CAP_Dup5: CAP CERAMIC 0.01uF 25V 10% X5R 0201; Mistral Part No: 120018010007-R; Mfr_name: MURATA; Mfr_part_number: GRM033R61E103KA12J; Part_type: CAPACITORS\CERAMIC; Wattage: NA; Project: TI_MAXIE_CPB; Customs_HS_Code: 85322990; Custom_Duty: 15%; PCB Footprint: CAP0201_0-5; MECHANICAL 3D STEP FILE: CAP0201_0-5; Temperature: -55°C+85°C; Weight: 0.33mg; Tolerance: 10%; Voltage: 25V; Package: 0201; Distributor_name: DIGIKEY; Distributor_part_number: GRM033R61E103KA12J-ND; Height: 0.33MM; Datasheet: Y:\MIS_DATABASE\DATASHEETS\CAPACITORS\GRM033R61E103KA12.PDF; Crtd /date: MANIRAJA/230118; Chkd/date: MANIRAJA/230118; Library Ref: CAP
C570 C576 = CAP_Dup5: as C116 on sheet 11-SoC POWER1; Footprint Path: Y:\MIS_DATABASE\Library\ALTIUM_TOOL\PCB_FOOTPRINTS\Altium_Footprint_Lib.PcbLib; Library Path: Y:\MIS_DATABASE\Library\ALTIUM_TOOL\SCHEMATICS_PARTS\MS_DISCRETE_Library.schlib; MECHANICAL 3D STEP FILE: CAP0402_0-75; PCB Footprint: CAP0402_0-75; Tolerance: 20%; Voltage: 16V; Package: 0402; Distributor_name: DIGIKEY; Distributor_part_number: 587-5514-1-ND; Height: 0.55MM; Weight: 0.65mg; Temperature: -55°C+85°C; Datasheet: Y:\MIS_DATABASE\DATASHEETS\CAPACITORS\EMK105BJ105MV-F.PDF; Crtd /date: ALVY/150218; Chkd/date: MANIRAJA/150218; Library Ref: CAP; Footprint Ref: CAP0402_0-75

## Sheet 14-SoC POWER4.SchDoc
size 513 x 386 mm
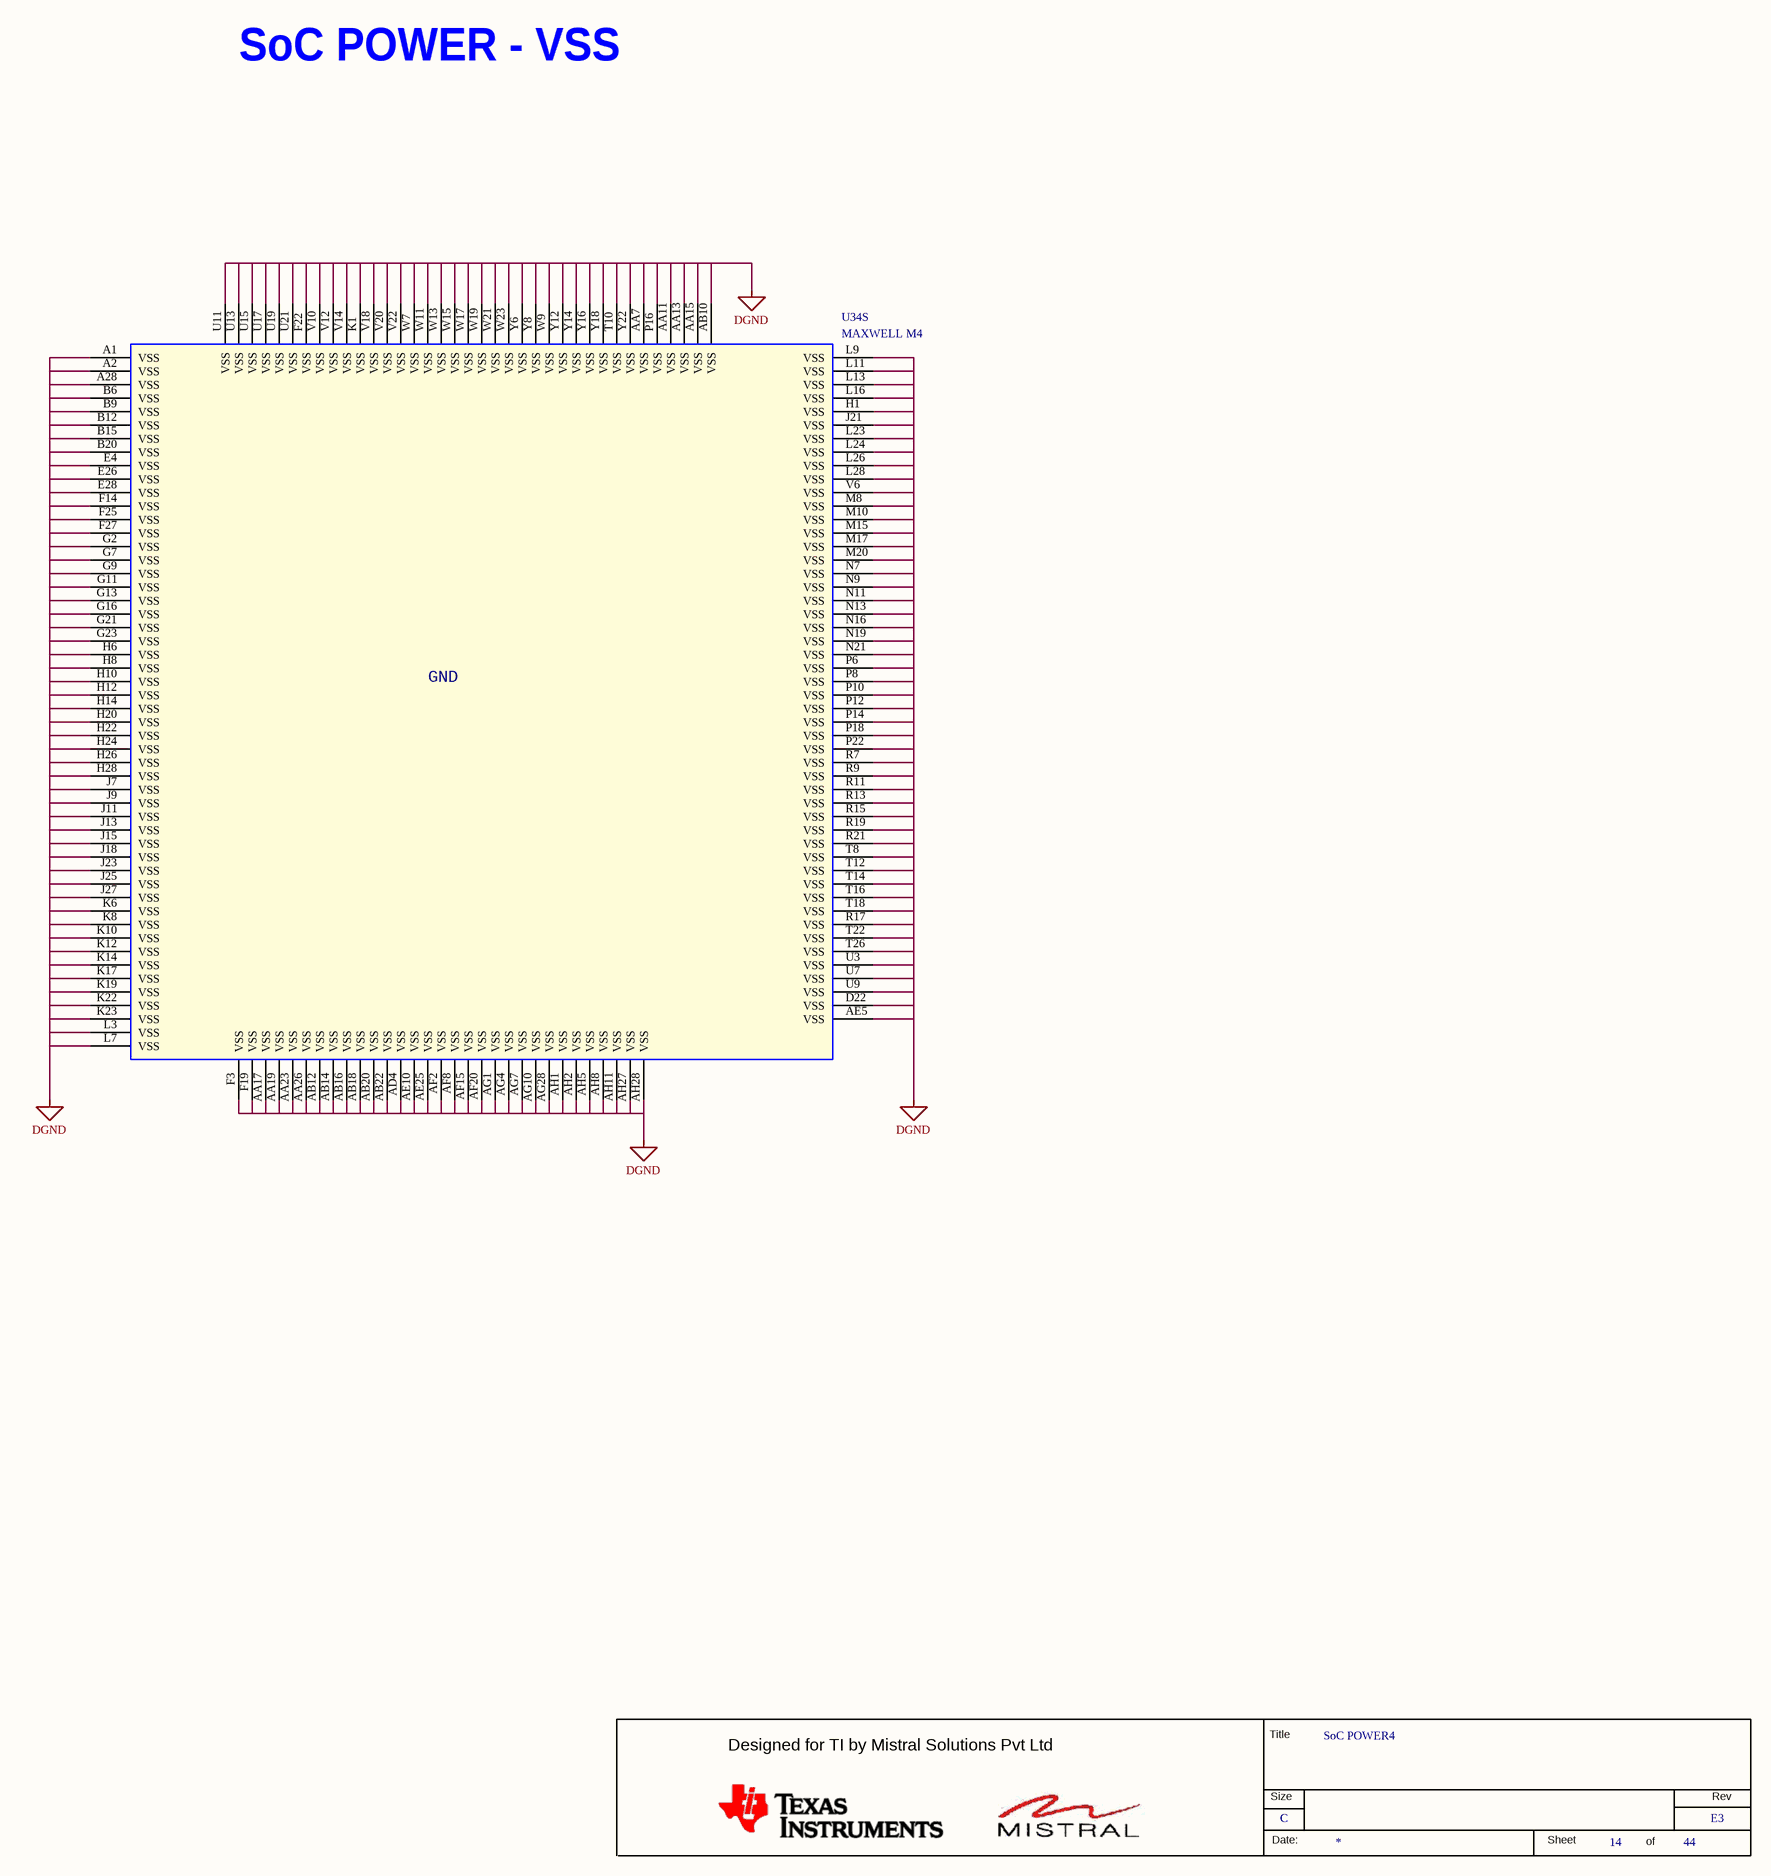
[diagram p19: 14-SoC POWER4.SchDoc]

### Parts
(Parts that share a designator on the sheet are numbered #1, #2 ... from top to bottom, then left to right.)
*#14  RevCode: E3  Title: SoC POWER4  Page Size: C  Page Number: 14  Page Count: 44  (hidden comment: MISTRAL_TITLEBLK_CSIZE)  (graphical)
U34  MAXWELL M4  [BGA784_31-49_910X910_1-7]  (part S of 19)

### Nets
DGND: U34.A1(VSS) U34.A2(VSS) U34.A28(VSS) U34.AA7(VSS) U34.AA11(VSS) U34.AA13(VSS) U34.AA15(VSS) U34.AA17(VSS) U34.AA19(VSS) U34.AA23(VSS) U34.AA26(VSS) U34.AB10(VSS) U34.AB12(VSS) U34.AB14(VSS) U34.AB16(VSS) U34.AB18(VSS) U34.AB20(VSS) U34.AB22(VSS) U34.AD4(VSS) U34.AE5(VSS) U34.AE10(VSS) U34.AE25(VSS) U34.AF2(VSS) U34.AF8(VSS) U34.AF15(VSS) U34.AF20(VSS) U34.AG1(VSS) U34.AG4(VSS) U34.AG7(VSS) U34.AG10(VSS) U34.AG28(VSS) U34.AH1(VSS) U34.AH2(VSS) U34.AH5(VSS) U34.AH8(VSS) U34.AH11(VSS) U34.AH27(VSS) U34.AH28(VSS) U34.B6(VSS) U34.B9(VSS) U34.B12(VSS) U34.B15(VSS) U34.B20(VSS) U34.D22(VSS) U34.E4(VSS) U34.E26(VSS) U34.E28(VSS) U34.F3(VSS) U34.F14(VSS) U34.F19(VSS) U34.F22(VSS) U34.F25(VSS) U34.F27(VSS) U34.G2(VSS) U34.G7(VSS) U34.G9(VSS) U34.G11(VSS) U34.G13(VSS) U34.G16(VSS) U34.G21(VSS) U34.G23(VSS) U34.H1(VSS) U34.H6(VSS) U34.H8(VSS) U34.H10(VSS) U34.H12(VSS) U34.H14(VSS) U34.H20(VSS) U34.H22(VSS) U34.H24(VSS) U34.H26(VSS) U34.H28(VSS) U34.J7(VSS) U34.J9(VSS) U34.J11(VSS) U34.J13(VSS) U34.J15(VSS) U34.J18(VSS) U34.J21(VSS) U34.J23(VSS) U34.J25(VSS) U34.J27(VSS) U34.K1(VSS) U34.K6(VSS) U34.K8(VSS) U34.K10(VSS) U34.K12(VSS) U34.K14(VSS) U34.K17(VSS) U34.K19(VSS) U34.K22(VSS) U34.K23(VSS) U34.L3(VSS) U34.L7(VSS) U34.L9(VSS) U34.L11(VSS) U34.L13(VSS) U34.L16(VSS) U34.L23(VSS) U34.L24(VSS) U34.L26(VSS) U34.L28(VSS) U34.M8(VSS) U34.M10(VSS) U34.M15(VSS) U34.M17(VSS) U34.M20(VSS) U34.N7(VSS) U34.N9(VSS) U34.N11(VSS) U34.N13(VSS) U34.N16(VSS) U34.N19(VSS) U34.N21(VSS) U34.P6(VSS) U34.P8(VSS) U34.P10(VSS) U34.P12(VSS) U34.P14(VSS) U34.P16(VSS) U34.P18(VSS) U34.P22(VSS) U34.R7(VSS) U34.R9(VSS) U34.R11(VSS) U34.R13(VSS) U34.R15(VSS) U34.R17(VSS) U34.R19(VSS) U34.R21(VSS) U34.T8(VSS) U34.T10(VSS) U34.T12(VSS) U34.T14(VSS) U34.T16(VSS) U34.T18(VSS) U34.T22(VSS) U34.T26(VSS) U34.U3(VSS) U34.U7(VSS) U34.U9(VSS) U34.U11(VSS) U34.U13(VSS) U34.U15(VSS) U34.U17(VSS) U34.U19(VSS) U34.U21(VSS) U34.V6(VSS) U34.V10(VSS) U34.V12(VSS) U34.V14(VSS) U34.V18(VSS) U34.V20(VSS) U34.V22(VSS) U34.W7(VSS) U34.W9(VSS) U34.W11(VSS) U34.W13(VSS) U34.W15(VSS) U34.W17(VSS) U34.W19(VSS) U34.W21(VSS) U34.W23(VSS) U34.Y6(VSS) U34.Y8(VSS) U34.Y12(VSS) U34.Y14(VSS) U34.Y16(VSS) U34.Y18(VSS) U34.Y22(VSS)

### Notes on the sheet
- SoC POWER - VSS
- (in symbol AM654X_BGA784, part S) GND
- (in symbol MISTRAL_TITLEBLK_CSIZE) Title; Designed for TI by Mistral Solutions Pvt Ltd; Size; Rev; Date:; Sheet; of

### Library data of the parts
*#14 = MISTRAL_TITLEBLK_CSIZE: Issue: 1.0; Page Create Date: March  8, 1995; Page Modify Date: *
U34 = AM654X_BGA784: as U34 on sheet 11-SoC POWER1; Voltage: NA; Wattage: NA; Package: BGA784; Distributor_name: NA; Distributor_part_number: NA; Height: 1.63MM; Weight: NA; Temperature: NA; Datasheet: Y:\MIS_DATABASE\DATASHEETS\ICS\DIGITAL\MICROCONTROLLER\MAXWELLM4.PDF; Crtd /date: MANIRAJA/130717; Chkd/date: MANIRAJA/130717; MECHANICAL 3D STEP FILE: BGA784_31-49_910X910_1-7; PCB Footprint: BGA784_31-49_910X910_1-7; Library Ref: AM654X_BGA784